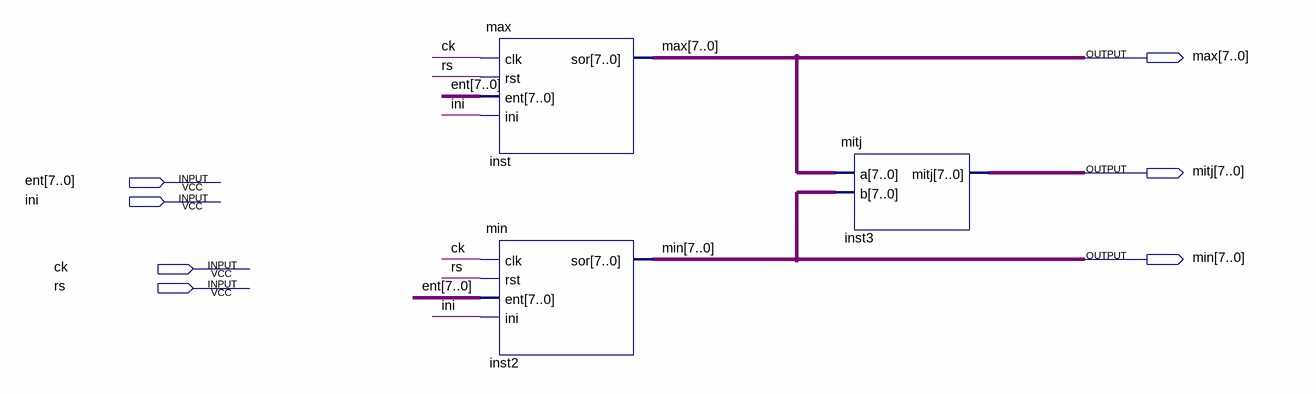
[diagram p0: schematic sheet]
// Quartus schematic 2024TG13.bdf as structural Verilog: 3 symbols, 7 pins
module \2024TG13  (
  input  [7:0] ent,
  input  ini,
  input  ck,
  input  rs,
  output [7:0] max,
  output [7:0] mitj,
  output [7:0] min
);

  max inst (.clk(ck), .rst(rs), .ent(ent), .ini(ini), .sor(max));
  min inst2 (.clk(ck), .rst(rs), .ent(ent), .ini(ini), .sor(min));
  mitj inst3 (.a(max), .b(min), .mitj(mitj));
endmodule
